# EAGLE design IED_GR_Module_Rev_01 (EAGLE 9.3.0)
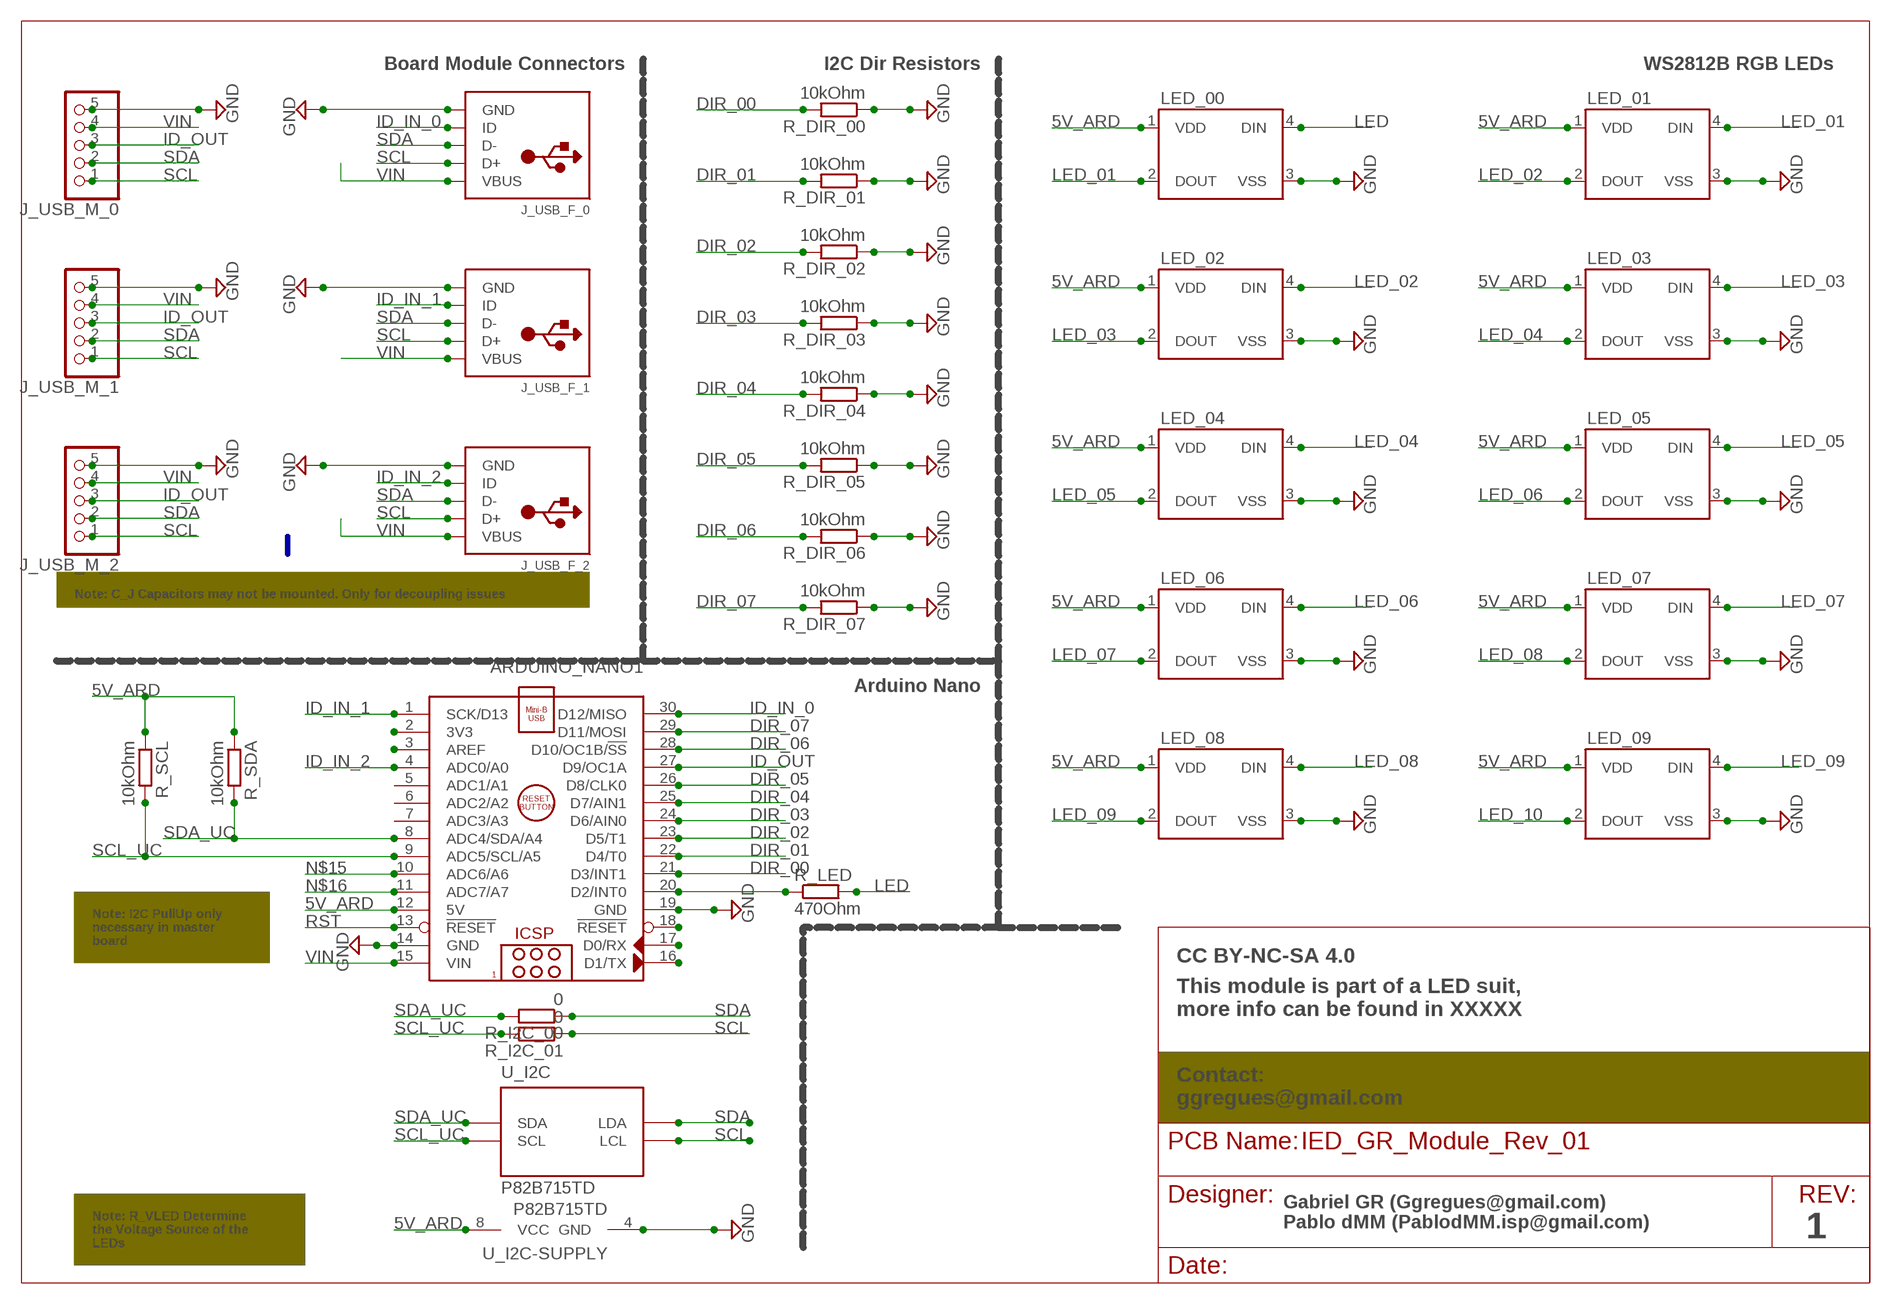
[diagram p0: schematic, sheet 1]

## Parts
ARDUINO_NANO1  ARDUINO_NANO  [ARDUINO_NANO]
J_USB_F_0  USBTHM  [USB-MINIB-THM]
J_USB_F_1  USBTHM  [USB-MINIB-THM]
J_USB_F_2  USBTHM  [USB-MINIB-THM]
J_USB_M_0  HEADER-1X51.27MM  [1X05_1.27MM]
J_USB_M_1  HEADER-1X51.27MM  [1X05_1.27MM]
J_USB_M_2  HEADER-1X51.27MM  [1X05_1.27MM]
LED_00  WS2812B  [WS2812B]
LED_01  WS2812B  [WS2812B]
LED_02  WS2812B  [WS2812B]
LED_03  WS2812B  [WS2812B]
LED_04  WS2812B  [WS2812B]
LED_05  WS2812B  [WS2812B]
LED_06  WS2812B  [WS2812B]
LED_07  WS2812B  [WS2812B]
LED_08  WS2812B  [WS2812B]
LED_09  WS2812B  [WS2812B]
R_DIR_00  10kOhm  R-EU_R1206  [R1206]
R_DIR_01  10kOhm  R-EU_R1206  [R1206]
R_DIR_02  10kOhm  R-EU_R1206  [R1206]
R_DIR_03  10kOhm  R-EU_R1206  [R1206]
R_DIR_04  10kOhm  R-EU_R1206  [R1206]
R_DIR_05  10kOhm  R-EU_R1206  [R1206]
R_DIR_06  10kOhm  R-EU_R1206  [R1206]
R_DIR_07  10kOhm  R-EU_R1206  [R1206]
R_I2C_00  0  R-EU_R1206  [R1206]
R_I2C_01  0  R-EU_R1206  [R1206]
R_LED  470Ohm  R-EU_R1206  [R1206]
R_SCL  10kOhm  R-EU_R1206  [R1206]
R_SDA  10kOhm  R-EU_R1206  [R1206]
U_I2C  P82B715TD  [SOIC-8]

## Nets
5V_ARD: ARDUINO_NANO1.12(5V) LED_00.1(VDD) LED_01.1(VDD) LED_02.1(VDD) LED_03.1(VDD) LED_04.1(VDD) LED_05.1(VDD) LED_06.1(VDD) LED_07.1(VDD) LED_08.1(VDD) LED_09.1(VDD) R_SCL.1 R_SDA.1 U_I2C.8(VCC)
DIR_00: ARDUINO_NANO1.21(D3/INT1) R_DIR_00.2
DIR_01: ARDUINO_NANO1.22(D4/T0) R_DIR_01.2
DIR_02: ARDUINO_NANO1.23(D5/T1) R_DIR_02.2
DIR_03: ARDUINO_NANO1.24(D6/AIN0) R_DIR_03.2
DIR_04: ARDUINO_NANO1.25(D7/AIN1) R_DIR_04.2
DIR_05: ARDUINO_NANO1.26(D8/CLK0) R_DIR_05.2
DIR_06: ARDUINO_NANO1.28(D10/OC1B/!SS) R_DIR_06.2
DIR_07: ARDUINO_NANO1.29(D11/MOSI) R_DIR_07.2
GND [GND]: ARDUINO_NANO1.14(GND) ARDUINO_NANO1.19(GND) J_USB_F_0.GND J_USB_F_1.GND J_USB_F_2.GND J_USB_M_0.5 J_USB_M_1.5 J_USB_M_2.5 LED_00.3(VSS) LED_01.3(VSS) LED_02.3(VSS) LED_03.3(VSS) LED_04.3(VSS) LED_05.3(VSS) LED_06.3(VSS) LED_07.3(VSS) LED_08.3(VSS) LED_09.3(VSS) R_DIR_00.1 R_DIR_01.1 R_DIR_02.1 R_DIR_03.1 R_DIR_04.1 R_DIR_05.1 R_DIR_06.1 R_DIR_07.1 U_I2C.4(GND)
ID_IN_0: ARDUINO_NANO1.30(D12/MISO) J_USB_F_0.ID
ID_IN_1: ARDUINO_NANO1.1(SCK/D13) J_USB_F_1.ID
ID_IN_2: ARDUINO_NANO1.4(ADC0/A0) J_USB_F_2.ID
ID_OUT: ARDUINO_NANO1.27(D9/OC1A) J_USB_M_0.3 J_USB_M_1.3 J_USB_M_2.3
LED: LED_00.4(DIN) R_LED.2
LED_01: LED_00.2(DOUT) LED_01.4(DIN)
LED_02: LED_01.2(DOUT) LED_02.4(DIN)
LED_03: LED_02.2(DOUT) LED_03.4(DIN)
LED_04: LED_03.2(DOUT) LED_04.4(DIN)
LED_05: LED_04.2(DOUT) LED_05.4(DIN)
LED_06: LED_05.2(DOUT) LED_06.4(DIN)
LED_07: LED_06.2(DOUT) LED_07.4(DIN)
LED_08: LED_07.2(DOUT) LED_08.4(DIN)
LED_09: LED_08.2(DOUT) LED_09.4(DIN)
LED_10: LED_09.2(DOUT)
LED_OUT: ARDUINO_NANO1.20(D2/INT0) R_LED.1
N$6: ARDUINO_NANO1.3(AREF)
N$8: ARDUINO_NANO1.2(3V3)
N$10: ARDUINO_NANO1.18(!RESET)
N$11: ARDUINO_NANO1.17(D0/RX)
N$12: ARDUINO_NANO1.16(D1/TX)
N$15: ARDUINO_NANO1.10(ADC6/A6)
N$16: ARDUINO_NANO1.11(ADC7/A7)
RST: ARDUINO_NANO1.13(!RESET)
SCL: J_USB_F_0.D+ J_USB_F_1.D+ J_USB_F_2.D+ J_USB_M_0.1 J_USB_M_1.1 J_USB_M_2.1 R_I2C_01.1 U_I2C.2(LCL)
SCL_UC: ARDUINO_NANO1.9(ADC5/SCL/A5) R_I2C_01.2 R_SCL.2 U_I2C.3(SCL)
SDA: J_USB_F_0.D- J_USB_F_1.D- J_USB_F_2.D- J_USB_M_0.2 J_USB_M_1.2 J_USB_M_2.2 R_I2C_00.1 U_I2C.7(LDA)
SDA_UC: ARDUINO_NANO1.8(ADC4/SDA/A4) R_I2C_00.2 R_SDA.2 U_I2C.6(SDA)
VIN [VCC]: ARDUINO_NANO1.15(VIN) J_USB_F_0.VBUS J_USB_F_1.VBUS J_USB_F_2.VBUS J_USB_M_0.4 J_USB_M_1.4 J_USB_M_2.4
Unconnected: ARDUINO_NANO1.5(ADC1/A1) ARDUINO_NANO1.6(ADC2/A2) ARDUINO_NANO1.7(ADC3/A3)

## Buses
B$1

## Notes on the sheet
- Board Module Connectors | I2C Dir Resistors | WS2812B RGB LEDs
- Note: C_J Capacitors may not be mounted. Only for decoupling issues
- Arduino Nano
- Note: I2C PullUp only
  necessary in master
  board
- CC BY-NC-SA 4.0
- This module is part of a LED suit,
  more info can be found in XXXXX
- Contact:
  ggregues@gmail.com
- Note: R_VLED Determine
  the Voltage Source of the
  LEDs
- Gabriel GR (Ggregues@gmail.com) 
  Pablo dMM (PablodMM.isp@gmail.com)
- 1

## Library data of the parts
ARDUINO_NANO1 = ArduinoNanoV30:ARDUINO_NANO: Arduino Nano V3.0 Module Overview: The Arduino Nano is a small, complete, and breadboard-friendly board based on the ATmega328 (Arduino Nano 3.x) or ATmega168 (Arduino Nano 2.x). It has more or less the same functionality of the Arduino Duemilanove, but in a different package. It lacks only a DC power jack, and works with a Mini-B USB cable instead of a standard one. The Nano was designed and is being produced by Gravitech <http://www.gravitech.us/arna30wiatp.html>. General specifications: Item Value Microcontroller Atmel ATmega168 or ATmega328 Operating Voltage (logic level) 5 V Input Voltage (recommended) 7-12 V Input Voltage (limits) 6-20 V Digital I/O Pins 14 (of which 6 provide PWM output) Analog Input Pins 8 DC Current per I/O Pin 40 mA Flash Memory 16 KB (ATmega168) or 32 KB (ATmega328) of which 2 KB used by bootloader SRAM 1 KB (ATmega168) or 2 KB (ATmega328) EEPROM 512 bytes (ATmega168) or 1 KB (ATmega328) Clock Speed 16 MHz Dimensions (Inches) 0.73" x 1.70" Dimensions (mm) 18mm x 45mm Overall height About 9 mm (not including pins) Weigth 5 g Power: The Arduino Nano can be powered via the Mini-B USB connection, 6-20V unregulated external power supply (pin 30), or 5V regulated external power supply (pin 27). The power source is automatically selected to the highest voltage source. Memory: The ATmega168 has 16 KB of flash memory for storing code (of which 2 KB is used for the bootloader); the ATmega328 has 32 KB, (also with 2 KB used for the bootloader). The ATmega168 has 1 KB of SRAM and 512 bytes of EEPROM (which can be read and written with the EEPROM library); the ATmega328 has 2 KB of SRAM and 1 KB of EEPROM. Input and Output: Each of the 14 digital pins on the Nano can be used as an input or output, using pinMode(), digitalWrite(), and digitalRead() functions. They operate at 5 volts. Each pin can provide or receive a maximum of 40 mA and has an internal pull-up resistor (disconnected by default) of 20-50 kOhms. In addition, some pins have specialized functions. Visit Arduino - ArduinoBoardNano <https://www.arduino.cc/en/Main/ArduinoBoardNano>
J_USB_F_0 J_USB_F_1 J_USB_F_2 = adafruit:USB: USB Connectors USBMINIB - Surface Mount Female Mini-B USB Connector 4UConnector: 06564 By microbuilder.eu Thru-hole RA Female Mini-B USB Connector 4UConnector: 18732 By ladyada.net
J_USB_M_0 J_USB_M_1 J_USB_M_2 = microbuilder:HEADER-1X5: PIN HEADER
LED_00 LED_01-LED_09 = SparkFun-LED:WS2812B: WS2812B - Intelligent control LED integrated light source Technical Specifications: Power Supply Voltage (VDD): 3.5 to 5.3 V Input Voltage (VI): -0.5 to VDD+0.5 V Operating Junction Temperature (Topt): -25°C to +80°C Storage Temperature Range (Tstg): -55°C to +150°C; PROD_ID: DIO-12503
R_DIR_00 R_DIR_01-R_DIR_07 R_I2C_00 R_I2C_01 R_LED R_SCL R_SDA = resistor:R-EU_: RESISTOR, European symbol
U_I2C = Volks73-NXPSemiconductors:P82B715?: I2C-Bus Extender I2C-bus extender Documentation Datasheet <http://www.nxp.com/documents/data_sheet/P82B715.pdf> General Description The P82B715 is a bipolar IC intended for application in I2C-bus and derivative bus systems. While retaining all the operating modes and features of the I2C-bus it permits extension of the practical separation distance between components on the I2C-bus by buffering both the data (SDA) and the clock (SCL) lines. The I2C-bus capacitance limit of 400 pF restricts practical communication distances to a few meters. Using one P82B715 at each end of a long cable (connecting Lx/Ly to Lx/Ly) reduces that cable’s loading on the linked I2C-buses by a factor of 10 and allows the total system capacitance load (all devices, cable, connectors, and traces or wires connected to the I2C-bus) to be around 3000 pF while the loading on each I2C-bus on the Sx/Sy sides remains below 400 pF. Longer cables or low-cost, general-purpose wiring may be used to link I2C-bus based modules without degrading noise margins. Multiple P82B715s can be connected together, linking their Lx/Ly ports, in a star or multi-point architecture as long as the total capacitance of the system is less than about 3000 pF and each bus at an Sx/Sy connection is well below 400 pF. This configuration, with the master and/or slave devices attached to the Sx/Sy port of each P82B715, has full multi-master communication capability. The P82B715 alone does not support voltage level translation, but it can be simply implemented using low cost transistors when required. There is no restriction on interconnecting the Sx/Sy I/Os, and, because the device output levels are always held within 100 mV of input drive levels, P82B715 is compatible with bus buffers that use voltage level offsets, e.g., PCA9511A, PCA9517, Sx/Sy side of P82B96. The lower VOL level and ability to operate with any master, slave or bus buffer is the primary advantage of the using the P82B715 for long distance buses at the disadvantage of not isolating bus capacitance like the P82B96 or PCA9600 are able to do. The primary disadvantage of the P82B96 and PCA9600 is that the static level offset needed to isolate bus capacitance does not allow these devices to operate with other bus buffers with special offset levels or with master/slaves that require a VIL lower than 0.8 V with noise margin. A proven quick design-in point-to-point/multi-point circuit (Figure 9) is included in Section 8.2 to allow rapid use of the P82B715 along with comparison waveforms so that the designer can clearly see the trade-offs between the P82B715 and the P82B96/PCA9600 and choose the type of device that is best for their application. Features Dual, bidirectional, unity voltage gain buffer with no external directional control required Compatible with I2C-bus and its derivatives SMBus, PMBus, DDC, etc. Logic signal levels may include (but not exceed) both supply and ground Logic signal input voltage levels are output without change and are independent of VCC ×10 impedance transformation, but does not change logic voltage levels Supply voltage range 3 V to 12 V Clock speeds to at least 100 kHz and 400 kHz when other system delays permit ESD protection exceeds 2500 V HBM per Mil. Std 883C-3015.7 and 400 V MM per JESD22-A115 (I/Os have diodes to VCC and GND) Latch-up testing is done to JEDEC Standard JESD78 which exceeds 100 mA Applications Increase the total connected capacitance of an I2C-bus system to around 3000 pF Drive I2C-bus signals over long cables to approximately 50 meters or 3000 pF Drives ×10 lower impedance bus wiring for improved noise immunity Multi-drop distribution of I2C-bus signals using low cost twisted-pair cables AdvancedTCA radial IPMB architecture Driving 30 mA Fm+ devices from standard 3 mA parts; APPLICATIONS: I2C; CAPACITANCE-INPUT: 3000pF; CURRENT_SUPPLY: 22mA; DATA_RATE: 400kHz; DELAY_TIME: -; DESCRIPTION: IC REDRIVER I2C 1CH 400KHZ 8SO; DOCUMENTATION_LINK: <a href="http://www.nxp.com/documents/data_sheet/P82B715.pdf">Datasheet</a>; DOCUMENTATION_URL: http://www.nxp.com/documents/data_sheet/P82B715.pdf; INPUT: 2-Wire Buse; MANUFACTURER: NXP Semiconductors; NUMBER_OF_CHANNELS: 1; OPERATING_TEMPERATURE: -40C ~ 85C; OUTPUT: 2-Wire Bus; PART_NUMBER: P82B715TD,118; SIGNAL_CONDITIONING: -; SUPPLIER_ITEM_LINK: <a href="http://www.digikey.com/product-detail/en/P82B715TD,118/568-1007-2-ND/735621">Details</a>; SUPPLIER_ITEM_NUMBER: 568-1007-2-ND; SUPPLIER_ITEM_URL: http://www.digikey.com/product-detail/en/P82B715TD,118/568-1007-2-ND/735621; SUPPLIER_LINK: <a href="http://www.digikey.com">Home Page</a>; SUPPLIER_NAME: Digi-Key; SUPPLIER_URL: http://www.digikey.com; TYPE: Buffer, ReDriver; VOLTAGE_SUPPLY: 4.5V ~ 12V

## Net classes
1 GND: width 0.254 mm
2 VCC: width 0.762 mm

## Board
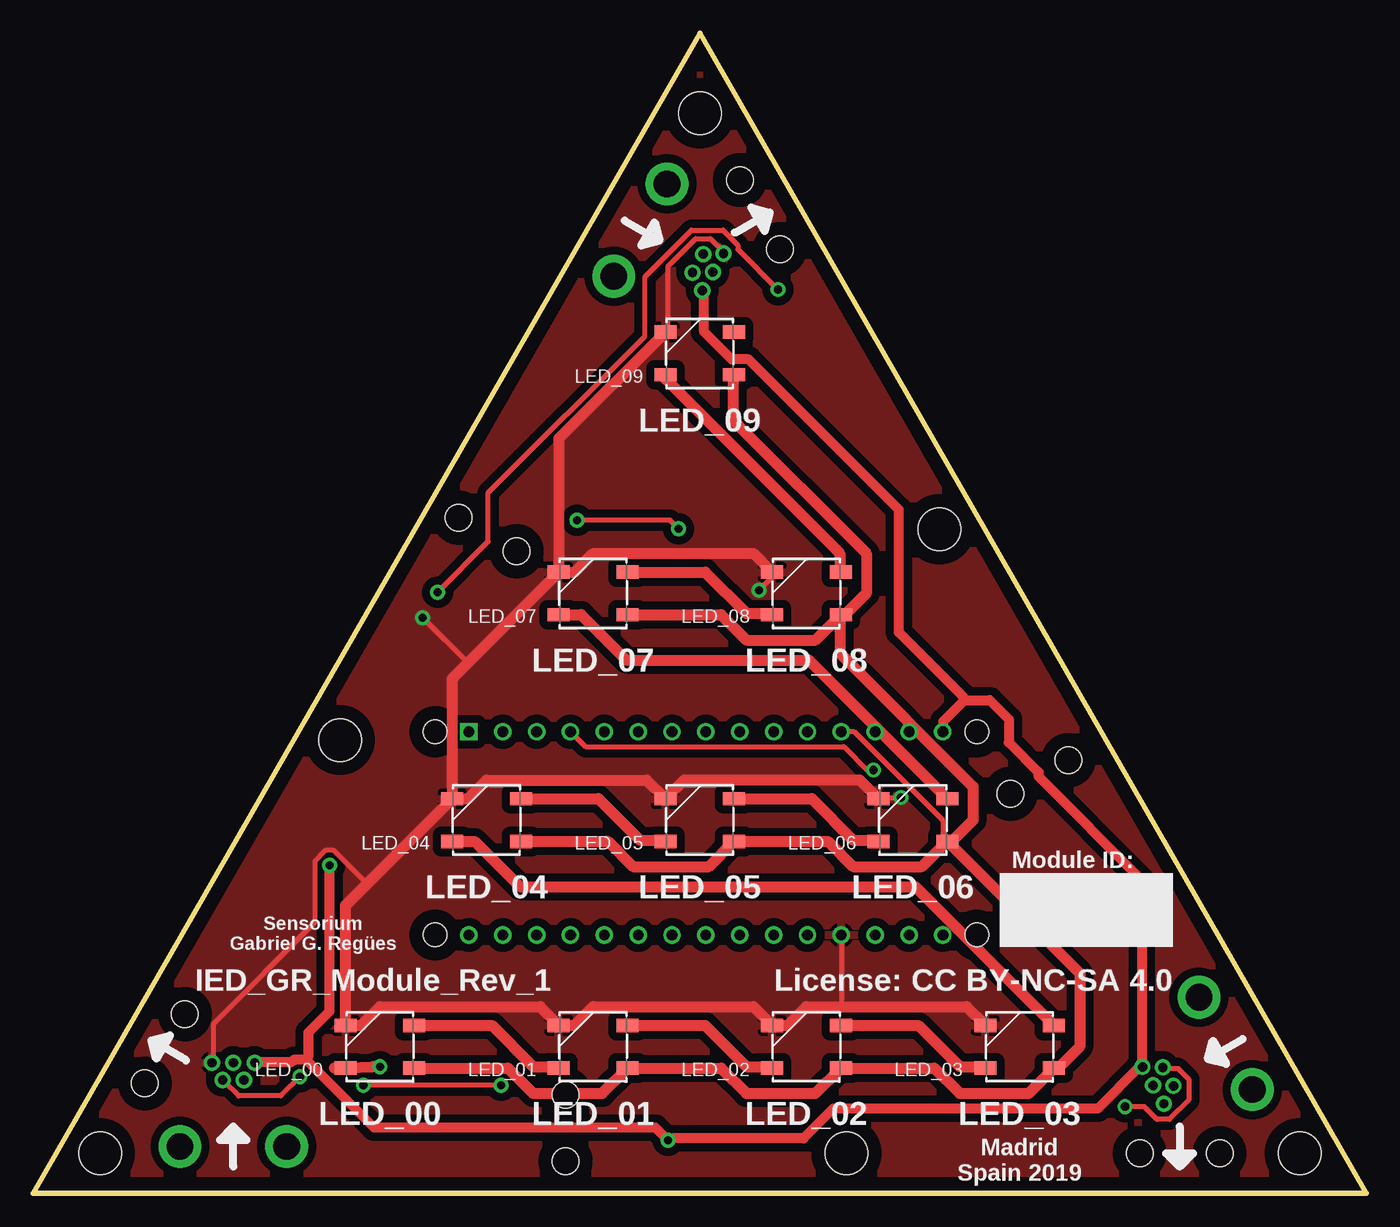
[diagram p1: board, top side]
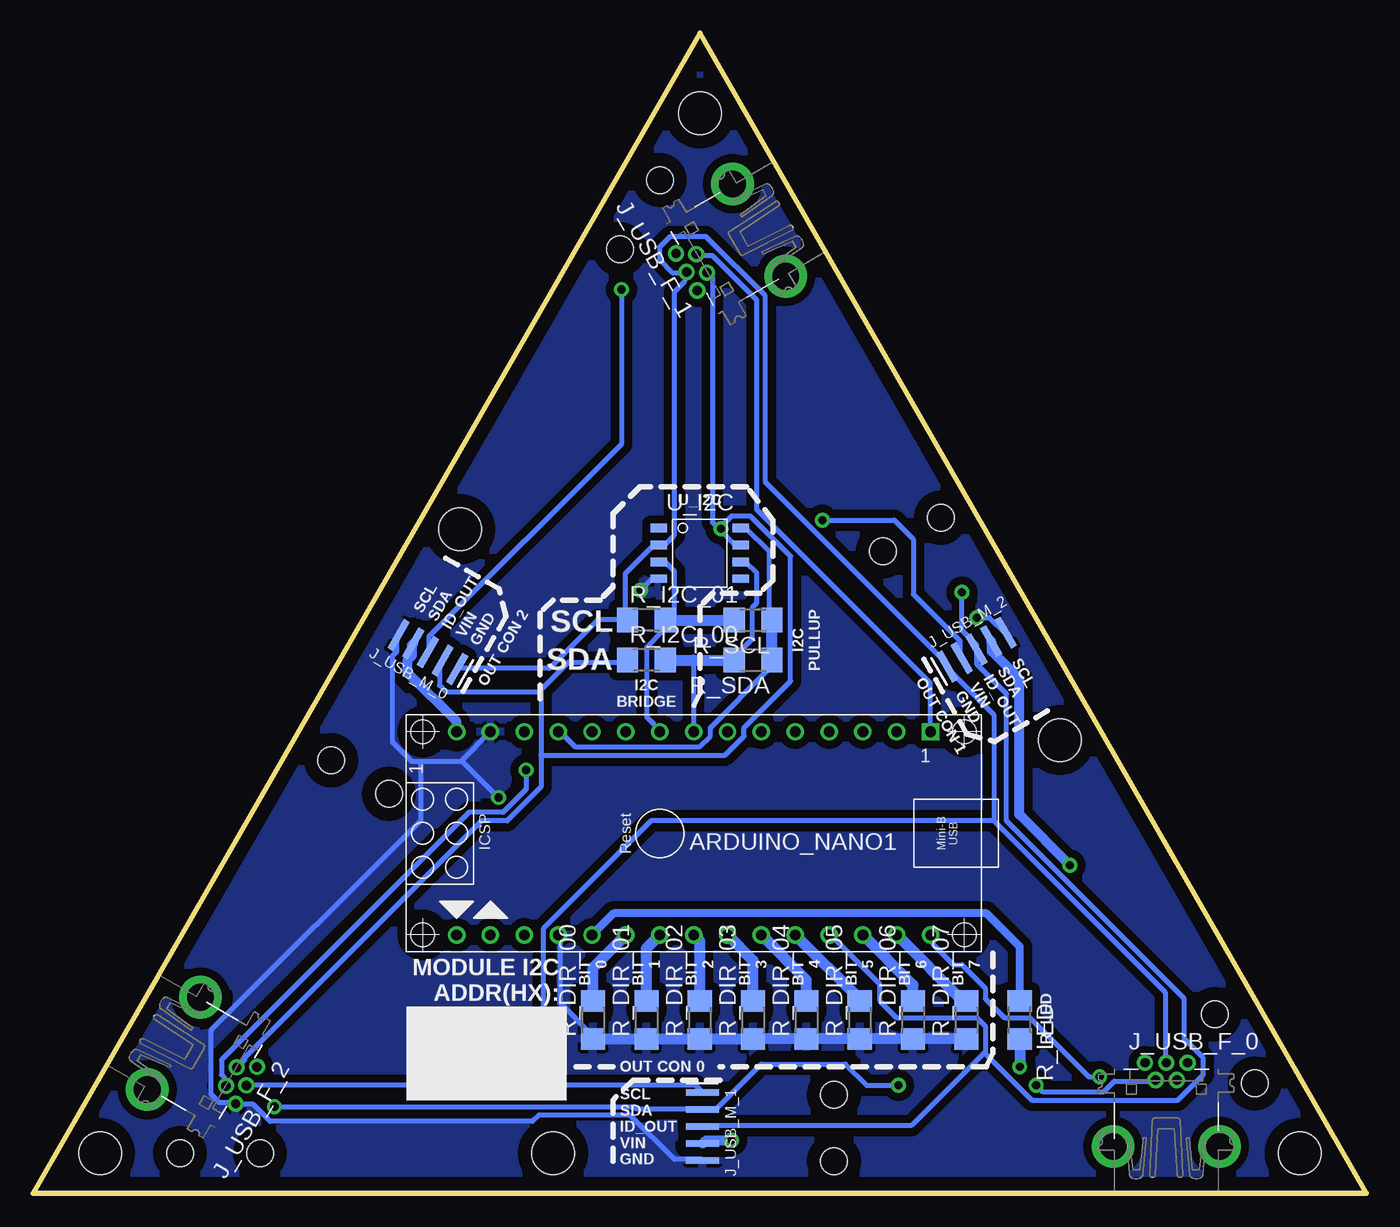
[diagram p2: board, bottom side, seen from below]

Size 100 x 87 mm. Coordinates in mm from the lower left corner, seen from the top.
Outline: 0,0 100,0 50,87 0,0
Copper layers (1*16): Top 0.035mm / dielectric 1.5mm / Bottom 0.035mm
Design rules "default *": minimum track width 15mil, minimum drill 24mil, track to track 10mil, track to pad 10mil, pad to pad 10mil, via to via 10mil, smd to smd 8mil, copper to edge 40mil, drill to drill 8mil, minimum pad ring 10mil, minimum via ring 10mil, stop-mask expansion 4mil, vias tented up to drill 0mil, thermal gap 10mil
Holes 2 mm at 83,3 89,3 8.37,8.24 11.37,13.44 53,76 56,70.8 39.94,2.4 39.94,7.4 31.92,50.66 36.25,48.16 77.65,32.47 73.32,29.97
Holes 3.2 mm at 5,3 95,3 61,3 50,81 23,34 67.97,49.81

### Footprints (pad centres in the part's own frame; a part is rotated, then mirrored left to right if it is on the bottom)
ARDUINO_NANO = drill 0.8 square: 1 -20.32,-7.62 | drill 0.8: 2 -17.78,-7.62; 3 -15.24,-7.62; 4 -12.7,-7.62; 5 -10.16,-7.62; 6 -7.62,-7.62; 7 -5.08,-7.62; 8 -2.54,-7.62; 9 0,-7.62; 10 2.54,-7.62; 11 5.08,-7.62; 12 7.62,-7.62; 13 10.16,-7.62; 14 12.7,-7.62; 15 15.24,-7.62; 16 15.24,7.62; 17 12.7,7.62; 18 10.16,7.62; 19 7.62,7.62; 20 5.08,7.62; 21 2.54,7.62; 22 0,7.62; 23 -2.54,7.62; 24 -5.08,7.62; 25 -7.62,7.62; 26 -10.16,7.62; 27 -12.7,7.62; 28 -15.24,7.62; 29 -17.78,7.62; 30 -20.32,7.62 | hole 1.778: -22.86,-7.62; -22.86,7.62; 17.78,7.62; 17.78,-7.62
USB-MINIB-THM = drill 0.7: D+ 0,9.8; D- -0.8,8.5; GND 1.6,9.8; ID 0.8,8.5; VBUS -1.6,9.8 | drill 2 pad 3.2: GND2 -4,3.52; GND3 4,3.52
1X05_1.27MM = smd 0.5 x 2.5: 1 -2.54,0; 2 -1.27,0; 3 0,0; 4 1.27,0; 5 2.54,0
WS2812B = smd 1.651 x 1: 1 -2.577,1.6; 2 -2.577,-1.6; 3 2.577,-1.6; 4 2.577,1.6
R1206 = smd 1.6 x 1.803: 1 -1.422,0; 2 1.422,0
SOIC-8 = smd 1.27 x 0.635: 1 -3.073,1.905; 2 -3.073,0.635; 3 -3.073,-0.635; 4 -3.073,-1.905; 5 3.073,-1.905; 6 3.073,-0.635; 7 3.073,0.635; 8 3.073,1.905

### Placement (x,y rotation side)
ARDUINO_NANO1  53,27 180 bottom
J_USB_F_0  15,0 0 bottom
J_USB_F_1  42.5,74 120 bottom
J_USB_F_2  92.5,13 240 bottom
J_USB_M_0  70.39,40.6 150 bottom
J_USB_M_1  49.79,5.01 270 bottom
J_USB_M_2  29.24,40.78 30 bottom
LED_00  26,11 180 top
LED_01  42,11 180 top
LED_02  58,11 180 top
LED_03  74,11 180 top
LED_04  34,28 180 top
LED_05  50,28 180 top
LED_06  66,28 180 top
LED_07  42,45 180 top
LED_08  58,45 180 top
LED_09  50,63 180 top
R_DIR_00  58,13 90 bottom
R_DIR_01  54,13 90 bottom
R_DIR_02  50,13 90 bottom
R_DIR_03  46,13 90 bottom
R_DIR_04  42,13 90 bottom
R_DIR_05  38,13 90 bottom
R_DIR_06  34,13 90 bottom
R_DIR_07  30,13 90 bottom
R_I2C_00  54,40 0 bottom
R_I2C_01  54,43 0 bottom
R_LED  26,13 270 bottom
R_SCL  46,43 180 bottom
R_SDA  46,40 180 bottom
U_I2C  50,48 0 bottom

### Tracks (layer width: path | path; a pad name or v marks a point on that pad's centre or on a via)
5V_ARD
  Top 0.381: ARDUINO_NANO1.12 60.64,34.61 61.59,34.61 68.26,27.94 68.26,26.83 LED_06.1
  Top 0.813: LED_00.1 35.6,9.4 37.5,7.5 42.68,7.5 LED_01.1 51.6,9.4 53.5,7.5 58.68,7.5 LED_02.1 67.6,9.4 69.5,7.5 74.68,7.5 LED_03.1 76.9,9.4 78.5,11 78.5,16.5 68.5,26.5 68.5,26.32 | LED_04.1 43.1,26.4 45,24.5 50.68,24.5 LED_05.1 59.6,26.4 61.5,24.5 66.68,24.5 68.5,26.32 | 68.5,26.32 LED_06.1 68.9,26.4 70.5,28 70.5,30.5 60.5,40.5 60.5,43.32 | LED_07.1 51.6,43.4 53.5,41.5 58.68,41.5 60.5,43.32 | 60.5,43.32 LED_08.1 60.9,43.4 62.5,45 62.5,48 52.5,58 52.5,61.32 LED_09.1 | 60.5,43.32 60.5,43.5
  Bottom 0.381: U_I2C.8 46.83,49.85 46.51,49.85 44.77,48.1 44.77,43.34 R_SCL.1 | R_SDA.1 44.77,39.69 44.77,39.37 49.21,34.92 49.21,34.29 50.01,33.5 59.37,33.5 60.48,34.61 ARDUINO_NANO1.12
  Bottom 0.813: R_SDA.1 R_SCL.1
DIR_00
  Bottom 0.813: R_DIR_00.2 58,16.92 ARDUINO_NANO1.21
DIR_01
  Bottom 0.813: R_DIR_01.2 54,18.38 ARDUINO_NANO1.22
DIR_02
  Bottom 0.813: R_DIR_02.2 50,18.92 ARDUINO_NANO1.23
DIR_03
  Bottom 0.813: R_DIR_03.2 46,17.46 ARDUINO_NANO1.24
DIR_04
  Bottom 0.813: R_DIR_04.2 42,16 ARDUINO_NANO1.25
DIR_05
  Bottom 0.813: R_DIR_05.2 38,14.54 ARDUINO_NANO1.26
DIR_06
  Bottom 0.813: R_DIR_06.2 34,15.62 ARDUINO_NANO1.28
DIR_07
  Bottom 0.813: R_DIR_07.2 30.26,14.42 ARDUINO_NANO1.29
GND  (via drill 0.61)
  Top 0.381: v54.45,45.24 55.4,46.2 LED_08.3 | 60.64,14 60.64,19.37 ARDUINO_NANO1.19 | 25.04,23.22 22.54,25.72 21.91,25.72 21.11,24.92 21.11,20.32 13.49,12.7 13.49,9.84 J_USB_F_0.GND | J_USB_F_1.GND 51.75,70.64 50.8,71.6 49.69,71.6 47.62,69.53 47.62,64.93 LED_09.3 | 32.61,39.78 v29.21,43.18 | v65.09,29.69 63.82,29.69 LED_06.3
  Top 0.813: LED_03.3 70.02,14 60.64,14 58,14 56.6,12.6 LED_02.3 54.02,14 42,14 40.6,12.6 LED_01.3 38.02,14 26,14 24.6,12.6 LED_00.3 23.42,21.6 25.04,23.22 LED_04.3 | LED_04.3 32.6,29.6 34,31 46.02,31 LED_05.3 48.82,31 62,31 63.4,29.6 LED_06.3 | LED_07.3 40.6,46.6 42,48 54.02,48 LED_08.3 | LED_07.3 32.61,39.78 31.42,38.6 LED_04.3 | LED_09.3 39.42,56.6 LED_07.3
  Bottom 0.381: J_USB_M_1.5 49.85,2.54 51.91,2.54 55.24,5.87 62.07,5.87 62.55,5.4 82.23,5.4 83.5,6.67 84.77,6.67 J_USB_F_2.GND 84.93,6.83 86.04,6.83 86.68,7.46 86.68,12.22 70.96,27.94 70.96,32.38 | 67.94,32.38 70.96,32.38 | 70.96,32.38 71.6,32.38 73.03,33.81 73.03,40.32 72.71,40.64 72.71,41.75 J_USB_M_0.5 | 67.94,32.38 65.72,34.61 ARDUINO_NANO1.14 | v54.45,45.24 53.66,46.04 53.18,46.04 U_I2C.4 | v29.21,43.18 28.26,43.18 27.15,42.07 J_USB_M_2.5 | v65.09,29.69 67.79,32.38 67.94,32.38 | R_DIR_00.1 58.1,11.91 60.48,14.29 60.48,19.37 ARDUINO_NANO1.19
  Bottom 0.813: R_DIR_07.1 R_DIR_06.1 R_DIR_05.1 R_DIR_04.1 R_DIR_03.1 R_DIR_02.1 R_DIR_01.1 R_DIR_00.1
  pour Top (isolate 0.61): 0,0 100,0 50,87
  pour Bottom (isolate 0.813): 0,0 100,0 50,87
ID_IN_0  (via drill 0.61)
  Top 0.381: v20,8.73 18.57,7.3 15.4,7.3 14.29,8.41 J_USB_F_0.ID
  Bottom 0.381: v20,8.73 20.8,8.73 25.24,13.18 27.15,13.18 28.57,14.61 28.57,15.4 30.32,17.14 30.96,17.14 32.54,18.73 32.54,19.37 ARDUINO_NANO1.30
ID_IN_1
  Bottom 0.381: J_USB_F_1.ID 50.16,70.33 49.05,70.33 45.72,66.99 45.72,51.28 32.7,38.26 32.7,34.77 ARDUINO_NANO1.1
ID_IN_2  (via drill 0.61)
  Top 0.381: v63.02,31.75 62.55,31.75 60.8,33.5 41.43,33.5 40.32,34.61 ARDUINO_NANO1.4
  Bottom 0.381: v63.02,31.75 63.02,30.32 64.77,28.57 67.31,28.57 85.88,10 85.88,8.89 85.57,8.57 85.57,8.1 J_USB_F_2.ID
ID_OUT  (via drill 0.61)
  Top 0.381: v55.88,67.79 52.86,70.8 52.86,71.12 51.75,72.23 49.37,72.23 45.88,68.74 45.88,64.29 34.13,52.55 34.13,48.9 v30.32,45.09
  Bottom 0.381: 28.65,10.56 28.57,10.64 28.57,12.54 29.21,13.18 35.24,13.18 36.51,14.45 36.51,15.72 40.16,19.37 ARDUINO_NANO1.27 | 28.65,10.56 34.13,5.08 49.69,5.08 J_USB_M_1.3 | 28.65,10.56 25.08,6.99 14.13,6.99 12.22,8.89 12.22,10.16 13.65,11.59 13.65,14.61 26.99,27.94 26.99,37.47 29.21,39.69 29.21,40.64 J_USB_M_2.3 29.21,40.96 29.21,41.12 30.32,42.23 v30.32,45.09 | v55.88,67.79 55.88,56.2 70.33,41.75 70.33,40.64 J_USB_M_0.3
LED  (via drill 0.6)
  Top 0.813: LED_00.4 22.6,9.4 25.5,9.5 v26,9.5
  Bottom 0.813: R_LED.2 v26,9.5
LED_01
  Top 0.813: LED_00.2 34.4,12.6 37.5,9.5 39.32,9.5 LED_01.4
LED_02
  Top 0.813: LED_01.2 50.4,12.6 53.5,9.5 55.32,9.5 LED_02.4
LED_03
  Top 0.813: LED_02.2 66.4,12.6 69.5,9.5 71.32,9.5 LED_03.4
LED_04
  Top 0.813: LED_04.4 33.1,26.4 36.5,23 66.18,23 LED_03.2
LED_05
  Top 0.813: LED_04.2 42.4,29.6 45.5,26.5 47.32,26.5 LED_05.4
LED_06
  Top 0.813: LED_05.2 58.4,29.6 61.5,26.5 63.32,26.5 LED_06.4
LED_07
  Top 0.813: LED_07.4 41.1,43.4 44.5,40 58.18,40 LED_06.2
LED_08
  Top 0.813: LED_07.2 50.4,46.6 53.5,43.5 55.32,43.5 LED_08.4
LED_09
  Top 0.813: LED_09.4 47.42,61.08 60.5,48 60.5,46.68 LED_08.2
LED_OUT
  Bottom 0.61: R_LED.1 26,18.5 28.5,21 56.46,21 ARDUINO_NANO1.20
N$1
  pour Top (isolate 0.61): 0,0 100,0 50,87
N$2
  pour Bottom (isolate 0.61): 0,0 100,0 50,87
SCL
  Bottom 0.381: J_USB_M_0.1 68.1,39.37 61.28,39.37 57.63,43.02 55.72,43.02 R_I2C_01.1 55.56,43.02 55.56,46.51 53.5,48.58 53.18,48.58 U_I2C.2 53.02,48.74 52.55,48.74 51.91,49.37 51.91,67.63 51.12,68.42 51.12,69.06 J_USB_F_1.D+ 51.28,69.06 52.07,69.06 53.02,70.01 53.02,70.96 52.23,71.75 49.53,71.75 45.09,67.31 45.09,53.34 31.43,39.69 J_USB_M_2.1 31.43,39.37 27.94,35.88 27.94,27.94 | 61.75,8.1 50.32,8.1 49.85,7.62 J_USB_M_1.1 | 61.75,8.1 83.98,8.1 J_USB_F_2.D+ | 27.94,27.94 15.08,15.08 15.08,9.84 J_USB_F_0.D+ | 61.75,8.1 61.75,19.84 53.66,27.94 27.94,27.94
SCL_UC
  Bottom 0.381: U_I2C.3 53.02,47.31 52.55,47.31 51.91,46.67 51.91,43.34 R_I2C_01.2 52.7,42.7 52.7,42.23 53.98,40.96 53.98,35.72 53.02,34.77 ARDUINO_NANO1.9
  Bottom 0.813: R_I2C_01.2 R_SCL.2
SDA  (via drill 0.61)
  Top 0.381: v40.8,50.48 47.78,50.48 v48.42,49.85 | v35.08,8.1 v24.77,8.1 | v81.92,6.51 83.34,6.51 84.3,5.56 85.25,5.56 86.68,6.99 86.68,8.57 85.88,9.37 84.77,9.37 J_USB_F_2.D-
  Bottom 0.381: 48.5,49.77 49.05,50.32 49.05,68.74 49.37,69.06 J_USB_F_1.D- | 48.5,49.77 47.47,48.74 46.99,48.74 U_I2C.7 | v40.8,50.48 35.4,50.48 33.97,49.05 33.97,44.93 30.48,41.43 30.48,40.16 J_USB_M_2.2 | 48.5,49.77 v48.42,49.85 48.42,50.01 47.62,50.8 46.2,50.8 43.18,47.78 43.18,38.42 46.67,34.92 46.67,34.29 48.1,32.86 61.91,32.86 | v24.77,8.1 24.29,7.62 19.68,7.62 18.89,8.41 15.88,8.41 J_USB_F_0.D- | v35.08,8.1 37.47,8.1 39.05,9.68 45.4,9.68 48.74,6.35 49.69,6.35 J_USB_M_1.2 49.85,6.35 54.77,6.35 54.93,6.51 v81.92,6.51 | 61.99,37.7 62.07,37.62 69.06,37.62 69.53,38.1 69.53,39.69 69.37,39.85 J_USB_M_0.2 | 61.99,37.7 59.85,39.85 55.56,39.85 R_I2C_00.1 | 61.91,32.86 61.91,37.62 61.99,37.7 | 61.91,32.86 61.91,30.48 64.45,27.94 66.36,27.94 84.14,10.16 84.14,10 84.61,9.53 J_USB_F_2.D-
SDA_UC
  Bottom 0.381: U_I2C.6 46.83,47.31 46.51,47.31 45.72,46.51 45.72,44.29 46.04,43.97 46.04,41.59 47.31,40.32 R_SDA.2 | 50.48,40 50.48,34.77 ARDUINO_NANO1.8
  Bottom 0.813: R_I2C_00.2 50.48,40 R_SDA.2
VIN  (via drill 0.61)
  Top 0.762: 20.48,10 19.53,10 19.37,9.84 16.67,9.84 J_USB_F_0.VBUS | 20.48,10 25.56,4.92 46.67,4.92 v47.62,3.97 47.94,4.13 57.78,4.13 60.01,6.35 79.85,6.35 82.87,9.37 J_USB_F_2.VBUS 83.19,9.53 83.19,23.5 75.41,31.27 75.41,31.59 73.18,33.81 73.18,35.56 71.75,36.99 69.85,36.99 | v22.23,24.61 22.23,13.65 20.64,12.06 20.64,10.32 20.48,10 | 69.85,36.99 68.26,35.4 68.26,34.77 ARDUINO_NANO1.15 | J_USB_F_1.VBUS 50.32,67.63 50.32,64.61 52.39,62.55 53.66,62.55 64.93,51.28 64.93,42.07 69.69,37.31 69.85,36.99
  Bottom 0.762: v47.62,3.97 49.53,3.97 49.69,3.81 J_USB_M_1.4 | v22.23,24.61 26.04,28.42 26.04,38.58 28.1,40.64 28.1,41.27 J_USB_M_2.4 | J_USB_M_0.4 71.6,41.12 71.6,40.32 71.91,40.01 71.91,39.05 68.26,35.4 68.26,34.77 ARDUINO_NANO1.15

### Text on the board
_tsilk: LED_09 | LED_07 | LED_08 | Module ID: | LED_04 | LED_05 | LED_06 | Sensorium / Gabriel G. Regües | IED_GR_Module_Rev_1 | License: CC BY-NC-SA 4.0 | LED_00 | LED_01 | LED_02 | LED_03 | Madrid / Spain 2019
_bsilk: U_I2C | OUT CON 2 | I2C / PULLUP | SCL / SDA | SCL / SDA / ID_OUT / VIN / GND | SCL / SDA / ID_OUT / VIN / GND | I2C / BRIDGE | OUT CON 1 | BIT / 7 | BIT / 6 | BIT / 5 | BIT / 4 | BIT / 3 | BIT / 2 | BIT / 1 | BIT / 0 | MODULE I2C / ADDR(HX): | R_LED | OUT CON 0 | SCL / SDA / ID_OUT / VIN / GND